# EAGLE design finderboard (EAGLE 4.16)
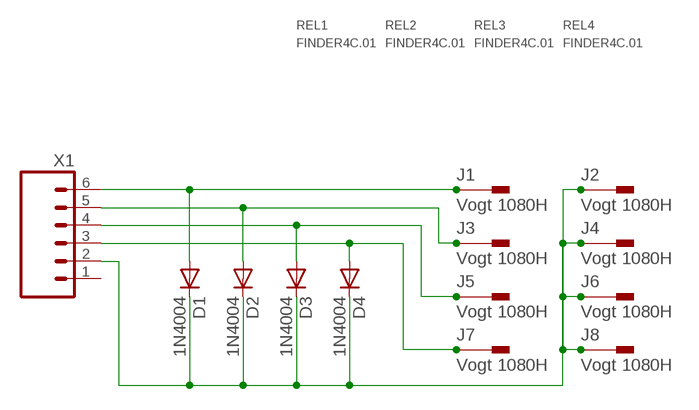
[diagram p0: schematic, sheet 1]

## Parts
D1  1N4004  1N40047  [DO41-7]
D2  1N4004  1N40047  [DO41-7]
D3  1N4004  1N40047  [DO41-7]
D4  1N4004  1N40047  [DO41-7]
J1  Vogt 1080H  PIN2H  [1080H.68]
J2  Vogt 1080H  PIN2H  [1080H.68]
J3  Vogt 1080H  PIN2H  [1080H.68]
J4  Vogt 1080H  PIN2H  [1080H.68]
J5  Vogt 1080H  PIN2H  [1080H.68]
J6  Vogt 1080H  PIN2H  [1080H.68]
J7  Vogt 1080H  PIN2H  [1080H.68]
J8  Vogt 1080H  PIN2H  [1080H.68]
REL1  FINDER4C.01  [FINDER4C.01]
REL2  FINDER4C.01  [FINDER4C.01]
REL3  FINDER4C.01  [FINDER4C.01]
REL4  FINDER4C.01  [FINDER4C.01]
X1  ML6L  [ML6L]

## Nets
N$1: D1.A J1.P@1 J1.P@2 X1.6
N$2: D2.A J3.P@1 J3.P@2 X1.5
N$3: D3.A J5.P@1 J5.P@2 X1.4
N$4: D4.A J7.P@1 J7.P@2 X1.3
VDRV: D1.C D2.C D3.C D4.C J2.P@1 J2.P@2 J4.P@1 J4.P@2 J6.P@1 J6.P@2 J8.P@1 J8.P@2 X1.2
Unconnected: X1.1

## Library data of the parts
D1-D4 = diode:1N4004: DIODE general purpose rectifier, 1 A
J1-J8 = con-bracketpin:PIN2: Flachstecker Typ tyco/Electronics/AMP Source: http://www.buerklin.com
REL1-REL4 = _frank:FINDER4C.01
X1 = con-harting-ml:ML6: HARTING

## Board
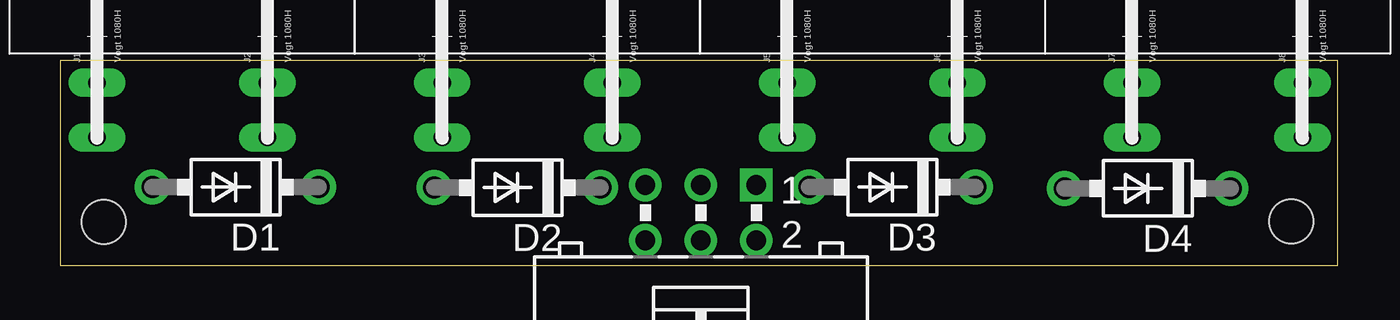
[diagram p1: board, top side]
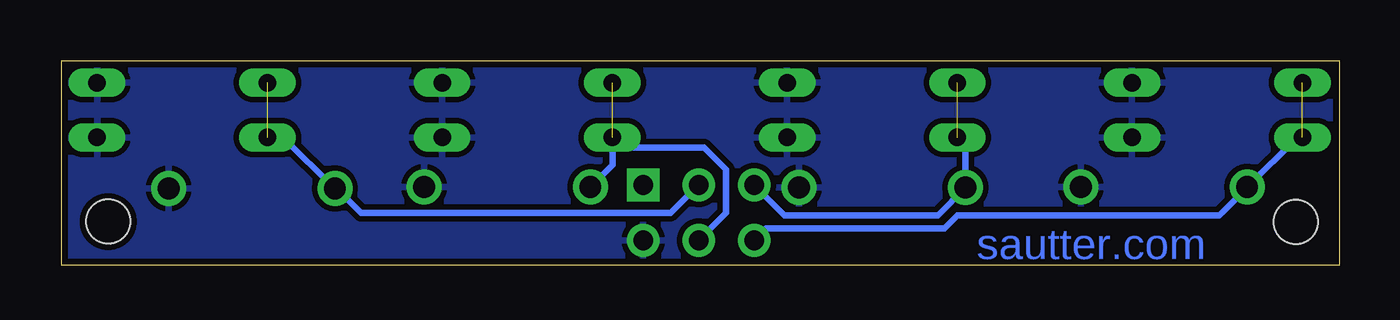
[diagram p2: board, bottom side, seen from below]

Size 58.52 x 9.38 mm. Coordinates in mm from the lower left corner, seen from the top.
Outline: 0,0 58.52,0 58.52,9.38 0,9.38 0,0
Copper layers (1*16): Top 0mm / dielectric 1.5mm / Bottom 0.035mm
Design rules "default": minimum track width 0.15mm, minimum drill 0.3mm, track to track 0.15mm, track to pad 0.15mm, pad to pad 0.15mm, via to via 0.15mm, smd to smd 0mil, copper to edge 0.3mm, drill to drill 0.15mm, minimum pad ring 0.15mm, minimum via ring 0.15mm, stop-mask expansion 4mil, vias tented up to drill 0mil, thermal gap 10mil
Holes 2 mm at 2,2 56.38,2

### Footprints (pad centres in the part's own frame; a part is rotated, then mirrored left to right if it is on the bottom)
DO41-7 = drill 1 pad 1.6 round: A 3.81,0; C -3.81,0
1080H.68 = drill 0.8 pad 1.3 long: P@1 0,0; P@2 2.5,0
ML6L = drill 0.9 pad 1.5 square: 1 -2.54,-1.27 | drill 0.9 pad 1.5 round: 2 -2.54,1.27; 3 0,-1.27; 4 0,1.27; 5 2.54,-1.27; 6 2.54,1.27

### Placement (x,y rotation side)
D1  8.03,3.58 180 top
D2  20.95,3.56 180 top
D3  38.11,3.58 180 top
D4  49.81,3.52 180 top
J1  1.7,5.87 90 top
J2  9.49,5.87 90 top
J3  17.5,5.87 90 top
J4  25.3,5.87 90 top
J5  33.29,5.87 90 top
J6  41.09,5.87 90 top
J7  49.09,5.87 90 top
J8  56.89,5.87 90 top
REL1  45.11,9.69 0 top
REL2  29.3,9.69 0 top
REL3  13.49,9.69 0 top
REL4  -2.31,9.69 0 top
X1  29.35,2.42 180 top

### Tracks (layer width: path | path; a pad name or v marks a point on that pad's centre or on a via)
N$1  (1 unrouted)
  Bottom 0.3: X1.6 26.26,1.7 18.1,1.7 17.5,2.29 5.5,2.29 4.29,3.5 4.29,3.52 D1.A 4.21,3.58 1.93,5.87 J1.P@1
N$2  (1 unrouted)
  Bottom 0.3: X1.5 25.42,2.29 18.39,2.29 17.1,3.6 17.11,3.6 D2.A 17.14,5.5 J3.P@1
N$3  (1 unrouted)
  Bottom 0.3: X1.4 28.1,2.4 28.1,4.4 29.1,5.4 32.79,5.4 33.2,5.79 33.22,5.79 J5.P@1 33.29,4.59 D3.A
N$4  (1 unrouted)
  Bottom 0.3: X1.3 30.64,2.4 44.79,2.4 45.79,3.4 45.88,3.4 D4.A 46.02,3.52 48.36,5.87 J7.P@1
VDRV
  pour Bottom (isolate 0.25): -0.01,-0.01 -0.01,9.4 58.49,9.41 58.52,-0.01

### Text on the board
Bottom: sautter.com